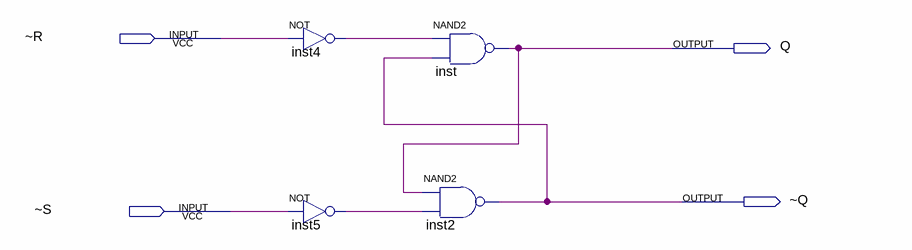
[diagram p0: schematic sheet]
// Quartus schematic lab9step1.bdf as structural Verilog: 4 symbols, 4 pins
module lab9step1 (
  input  \~R ,
  input  \~S ,
  output Q,
  output \~Q 
);

  wire inst4_out, inst5_out;

  not inst4 (inst4_out, \~R );
  not inst5 (inst5_out, \~S );
  nand inst (Q, inst4_out, \~Q );
  nand inst2 (\~Q , Q, inst5_out);
endmodule
